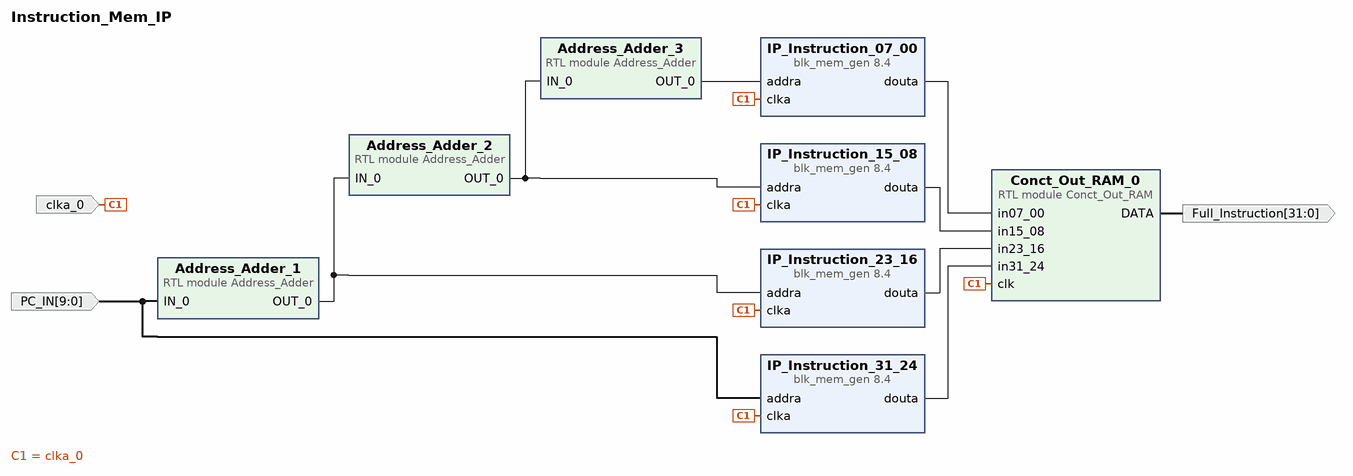
[diagram p0: block diagram of the top level]
# Vivado block design Instruction_Mem_IP, xc7z010clg400-1, Vivado 2023.2
create_bd_design Instruction_Mem_IP

create_bd_port -dir I -from 9 -to 0 PC_IN
create_bd_port -dir I -type clk clka_0
create_bd_port -dir O -from 31 -to 0 Full_Instruction

create_bd_cell -type ip -vlnv xilinx.com:ip:blk_mem_gen:8.4 IP_Instruction_31_24
set_property -dict [list \
  CONFIG.Coe_File ../Program.coe \
  CONFIG.Enable_A Always_Enabled \
  CONFIG.Fill_Remaining_Memory_Locations true \
  CONFIG.Load_Init_File true \
  CONFIG.Operating_Mode_A READ_FIRST \
  CONFIG.Register_PortA_Output_of_Memory_Primitives false \
  CONFIG.Write_Depth_A 1024 \
  CONFIG.Write_Width_A 8 \
  CONFIG.use_bram_block Stand_Alone \
] [get_bd_cells IP_Instruction_31_24]
create_bd_cell -type ip -vlnv xilinx.com:ip:blk_mem_gen:8.4 IP_Instruction_07_00
set_property -dict [list \
  CONFIG.Coe_File ../Program.coe \
  CONFIG.Enable_A Always_Enabled \
  CONFIG.Fill_Remaining_Memory_Locations true \
  CONFIG.Load_Init_File true \
  CONFIG.Operating_Mode_A READ_FIRST \
  CONFIG.Register_PortA_Output_of_Memory_Primitives false \
  CONFIG.Write_Depth_A 1024 \
  CONFIG.Write_Width_A 8 \
  CONFIG.use_bram_block Stand_Alone \
] [get_bd_cells IP_Instruction_07_00]
create_bd_cell -type ip -vlnv xilinx.com:ip:blk_mem_gen:8.4 IP_Instruction_15_08
set_property -dict [list \
  CONFIG.Coe_File ../Program.coe \
  CONFIG.Enable_A Always_Enabled \
  CONFIG.Fill_Remaining_Memory_Locations true \
  CONFIG.Load_Init_File true \
  CONFIG.Operating_Mode_A READ_FIRST \
  CONFIG.Register_PortA_Output_of_Memory_Primitives false \
  CONFIG.Write_Depth_A 1024 \
  CONFIG.Write_Width_A 8 \
  CONFIG.use_bram_block Stand_Alone \
] [get_bd_cells IP_Instruction_15_08]
create_bd_cell -type ip -vlnv xilinx.com:ip:blk_mem_gen:8.4 IP_Instruction_23_16
set_property -dict [list \
  CONFIG.Coe_File ../Program.coe \
  CONFIG.Enable_A Always_Enabled \
  CONFIG.Fill_Remaining_Memory_Locations true \
  CONFIG.Load_Init_File true \
  CONFIG.Operating_Mode_A READ_FIRST \
  CONFIG.Register_PortA_Output_of_Memory_Primitives false \
  CONFIG.Write_Depth_A 1024 \
  CONFIG.Write_Width_A 8 \
  CONFIG.use_bram_block Stand_Alone \
] [get_bd_cells IP_Instruction_23_16]
create_bd_cell -type module -reference Address_Adder Address_Adder_1
create_bd_cell -type module -reference Address_Adder Address_Adder_2
create_bd_cell -type module -reference Address_Adder Address_Adder_3
create_bd_cell -type module -reference Conct_Out_RAM Conct_Out_RAM_0

# ---- connections ----

connect_bd_net [get_bd_pins Address_Adder_1/OUT_0] [get_bd_pins IP_Instruction_23_16/addra] [get_bd_pins Address_Adder_2/IN_0]
connect_bd_net [get_bd_pins Address_Adder_2/OUT_0] [get_bd_pins IP_Instruction_15_08/addra] [get_bd_pins Address_Adder_3/IN_0]
connect_bd_net [get_bd_pins Address_Adder_3/OUT_0] [get_bd_pins IP_Instruction_07_00/addra]
connect_bd_net [get_bd_pins Conct_Out_RAM_0/DATA] [get_bd_ports Full_Instruction]
connect_bd_net [get_bd_pins IP_Instruction_07_00/douta] [get_bd_pins Conct_Out_RAM_0/in07_00]
connect_bd_net -net IP_Instruction_23_16_douta [get_bd_pins IP_Instruction_15_08/douta] [get_bd_pins Conct_Out_RAM_0/in15_08]
connect_bd_net -net IP_Instruction_23_16douta [get_bd_pins IP_Instruction_23_16/douta] [get_bd_pins Conct_Out_RAM_0/in23_16]
connect_bd_net [get_bd_pins IP_Instruction_31_24/douta] [get_bd_pins Conct_Out_RAM_0/in31_24]
connect_bd_net -net addra_0_1 [get_bd_ports PC_IN] [get_bd_pins IP_Instruction_31_24/addra] [get_bd_pins Address_Adder_1/IN_0]
connect_bd_net -net clka_0_1 [get_bd_ports clka_0] \
  [get_bd_pins IP_Instruction_31_24/clka] [get_bd_pins IP_Instruction_23_16/clka] [get_bd_pins IP_Instruction_15_08/clka] \
  [get_bd_pins IP_Instruction_07_00/clka] [get_bd_pins Conct_Out_RAM_0/clk]

validate_bd_design
save_bd_design
